# Altium schematic sheet Power_Stage.SchDoc
size A4; DocumentNumber: 3; SheetNumber: 3; SheetTotal: 3
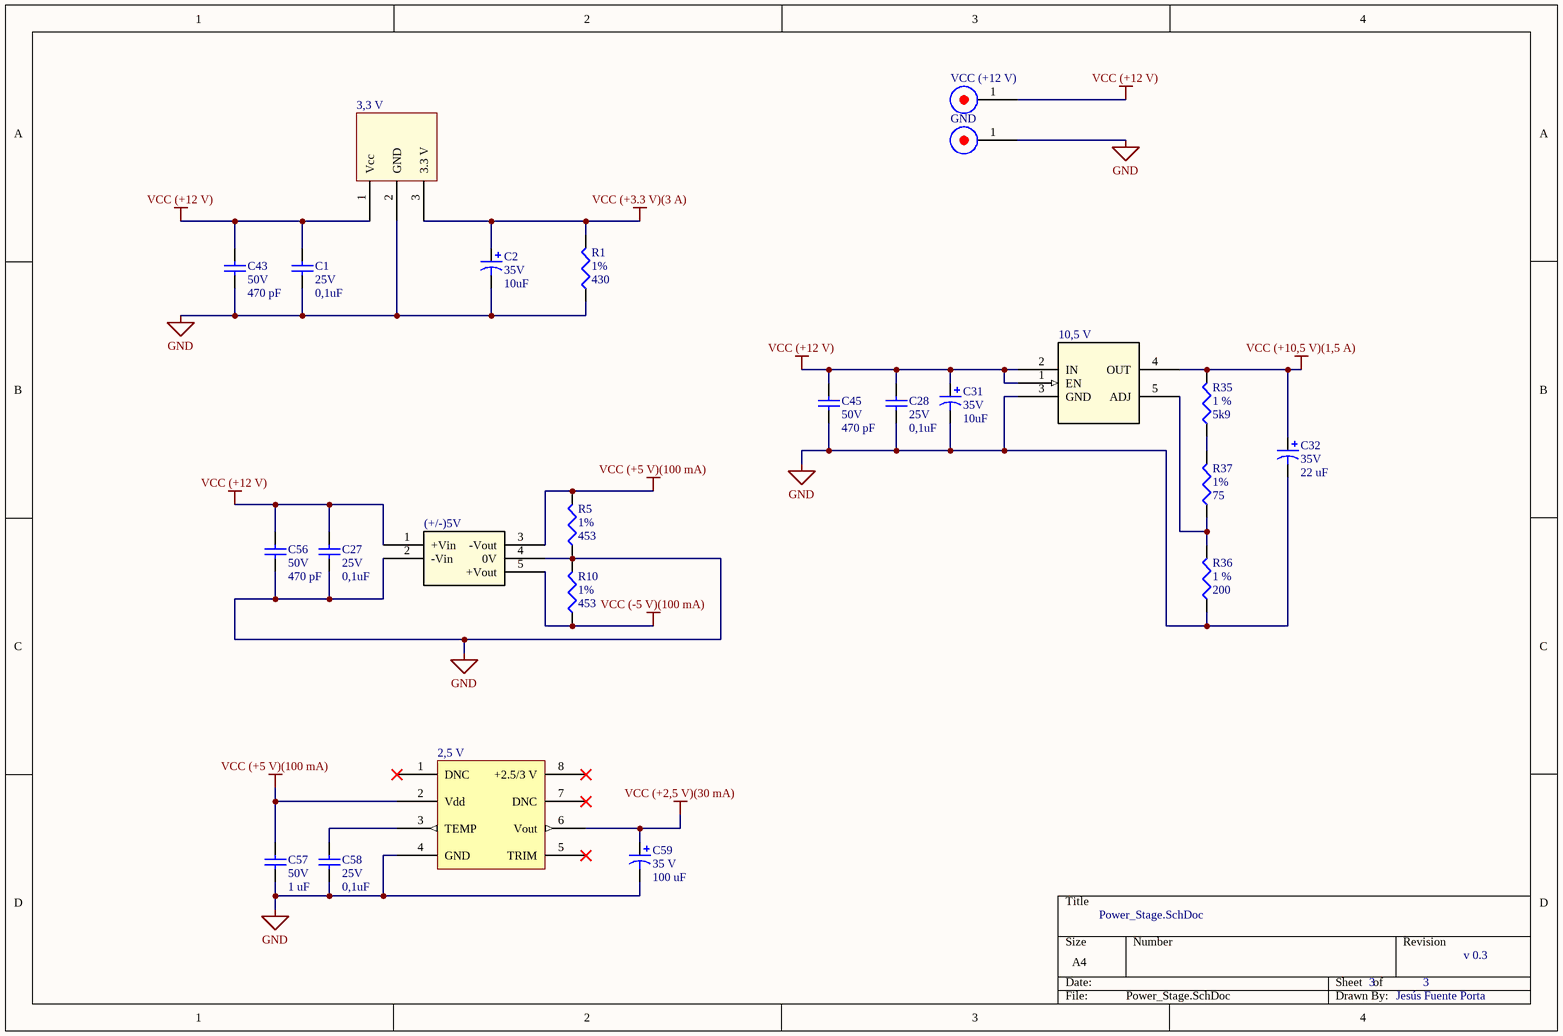
[diagram p0: Power_Stage.SchDoc]

## Parts
2,5_V  AD780CRZ  [AD780ARZ]  (value not drawn)
3,3_V  MIC29300-3.3WU  [MIC29300]  (value not drawn)
10,5_V  MIC29152WU  [MIC29152WU]  (value not drawn)
(+/-)5V  IA1205S  [IA0305S]  (value not drawn)
C1  25V  value 0,1uF  [1206 [Métrica 3216]]
C2  35V  value 10uF  [EEE1VA100WR]
C27  25V  value 0,1uF  [1206 [Métrica 3216]]
C28  25V  value 0,1uF  [1206 [Métrica 3216]]
C31  35V  value 10uF  [EEE1VA100WR]
C32  35V  value 22 uF  [EEE1VA220WR]
C43  50V  value 470 pF  [1206 [Métrica 3216]]
C45  50V  value 470 pF  [1206 [Métrica 3216]]
C56  50V  value 470 pF  [1206 [Métrica 3216]]
C57  50V  value 1 uF  [1206 [Métrica 3216]]
C58  25V  value 0,1uF  [1206 [Métrica 3216]]
C59  35 V  value 100 uF  [EEE-1VA101XP]
GND  Banana connector  [Banana Connector]  (value not drawn)
R1  1%  value 430  [1206 [Métrica 3216]]
R5  1%  value 453  [1206 [Métrica 3216]]
R10  1%  value 453  [1206 [Métrica 3216]]
R35  1 %  value 5k9  [1206 [Métrica 3216]]
R36  1 %  value 200  [1206 [Métrica 3216]]
R37  1%  value 75  [1206 [Métrica 3216]]
VCC_(+12_V)  Banana connector  [Banana Connector]  (value not drawn)

## Nets
GND: 2,5_V.4(GND) 3,3_V.2(GND) 10,5_V.3(GND) (+/-)5V.2(-Vin) (+/-)5V.4(0V) C1.1 C2.2 C27.1 C28.1 C31.2 C32.2 C43.1 C45.1 C56.1 C57.1 C58.1 C59.2 GND.1(IN) R1.1 R5.1 R10.2 R36.1
VCC (+2,5 V)(30 mA): 2,5_V.6(Vout) C59.1
VCC (+3.3 V)(3 A): 3,3_V.3(3.3_V) C2.1 R1.2
VCC (+5 V)(100 mA): 2,5_V.2(Vdd) (+/-)5V.3(-Vout) C57.2 R5.2
VCC (+10,5 V)(1,5 A): 10,5_V.4(OUT) C32.1 R35.2
VCC (+12 V): 3,3_V.1(Vcc) 10,5_V.1(EN) 10,5_V.2(IN) (+/-)5V.1(+Vin) C1.2 C27.2 C28.2 C31.1 C43.2 C45.2 C56.2 VCC_(+12_V).1(IN)
VCC (-5 V)(100 mA): (+/-)5V.5(+Vout) R10.1
Net2,5_V_3: 2,5_V.3(TEMP) C58.2
Net10,5_V_5: 10,5_V.5(ADJ) R36.2 R37.1
NetR35_1: R35.1 R37.2

Not connected (* = marked no-connect by the designer): 2,5_V 1(DNC)* 5(TRIM)* 7(DNC)* 8(+2.5/3_V)*

## Notes on the sheet
- (near C1) Choose a capacitor with good characteristics above 250 kHz.
- (near R1) Minimum 3,3 V Regulator Load to Enable Voltage Regulation. In case of < 7 mA current Load, the Voltage Regulators doesn't regulate the output.
- Choose a capacitor with good characteristics above 250 kHz.
- (near C32) Minimum 10,5 V Regulator Load to Enable Voltage Regulation. In case of < 5 mA current Load, the Voltage Regulators doesn't regulate the output.
  (R35+R37) = R36 * (Vout/1.240 - 1)
- (near (+/-)5V) Choose a capacitor with good characteristics above 250 kHz.
- (near (+/-)5V) Vin = 12 V +/- 10 %
  Vin = [10,8 V ; 13,2 V]
- Minimum 5 V Regulator Load to Enable Voltage Regulation. In case of < 20 mA current Load, the Voltage Regulators doesn't regulate the output.
- Line Regulation = 1.2%/1% ∆Vin
  Load Regulation = 10% (20-100% load change)
  Setpoint Accuracy = ±3%
  Maximum Capacitive Load = ±100 µF
  Switching Frequency = Variable, 80 KHz typical
  Efficiency = 75%
- High Precision 2,5 V reference.
- v 0.3
- Jesús Fuente Porta

## Library data of the parts
2,5_V = AD780ARZ: AD780CRZ -  Referencia de Tensión, Alta Precisión, Serie - Programable, Serie AD780, 2.5V, 3V, NSOIC-8; ComponentLink1Description: Farnell Webpage; ComponentLink1URL: https://es.farnell.com/analog-devices/ad780arz/ref-de-tensi-n-serie-2-5v-3v-nsoic/dp/2112642?scope=partnumberlookahead&ost=AD780ARZ&searchref=searchlookahead&exaMfpn=true&ddkey=https%3Aes-ES%2FElement14_Spain%2Fw%2Fsearch; ComponentLink2Description: Farnell Webpage (Compatible Chip); ComponentLink2URL: https://es.farnell.com/analog-devices/ad780crz/ref-de-tensi-n-serie-2-5v-3v-nsoic/dp/2461818?st=AD780
3,3_V = MIC29300-3.3WU: MIC29300-3.3WU -  Regulador de Tensión Fija LDO, 2.5 V a 26 V, Caída de 370 mV, 3.3 Vout, 3 Aout, TO-263-3; ComponentLink1Description: Farnell WebPage; ComponentLink1URL: https://es.farnell.com/microchip/mic29300-3-3wu/ic-reg-ldo-3a-3-3v/dp/2510017?st=MIC29300-3.3WU
10,5_V = MIC29152WU: MIC29152WU -  Regulador de Tensión LDO, Ajustable, Entrada 2V a 26V, Caída 350mV, Salida 1.27V-25V/1.5A, TO-263-5; Manufacturer_Part_Number: MIC29152BU; Vendor: Micrel; Built_By: EMA_UL_Team; Copyright: Copyright (C) 2018 Accelerated Designs. All rights reserved; RefDes: RefDes; Type: DEV; Value: Value; ComponentLink1Description: Farnell WebPage; ComponentLink1URL: https://es.farnell.com/microchip/mic29152wu/ic-v-reg-ldo-1-5a-adj-smd-29152/dp/2510008?scope=partnumberlookahead&ost=MIC29152WU&searchref=searchlookahead&exaMfpn=true&ddkey=https%3Aes-ES%2FElement14_Spain%2Fw%2Fsearch
(+/-)5V = IA1205S: IA1205S -  Convertidor DC/DC Aislado de Montaje en Placa, Orificio Pasante, 1W, 5V, 100mA, -5V, 100mA; Manufacturer_Part_Number: MIC29152BU; Vendor: Micrel; Built_By: EMA_UL_Team; Copyright: Copyright (C) 2018 Accelerated Designs. All rights reserved; RefDes: RefDes; Type: DEV; Value: Value; ComponentLink1Description: Farnell WebPage; ComponentLink1URL: https://es.farnell.com/xp-power/ia1205s/converter-dc-dc-1w-5v/dp/8727546
C1 C27 C28 C58 = Cap Semi: VJ1206Y104KXXCW1BC -  Condensador de Cerámica Multicapa, 0.1 µF, 25 V, 1206 [Métrica 3216], ± 10%, X7R, VJ Series; Published: 8-Jun-2000; LatestRevisionDate: 29-May-2009; LatestRevisionNote: IPC-7351 Footprint Added.; PackageReference: C1206; Publisher: Altium Limited; PackageDescription: Chip Capacitor; ComponentLink1Description: Farnell; ComponentLink1URL: https://es.farnell.com/vishay/vj1206y104kxxcw1bc/conden-0-1-f-25v-10-x7r-1206/dp/2896645
C2 C31 = Cap Pol3: EEE1VA100WR -  Condensador Electrolítico Aluminio SMD, Radial - SMD, 10 µF, 35 V, S Series, 1000 horas a 85°C; Published: 8-Jun-2000; LatestRevisionDate: 29-May-2009; LatestRevisionNote: IPC-7351 Footprint Added.; PackageReference: C0805; Publisher: Altium Limited; PackageDescription: Chip Capacitor; ComponentLink1Description: Farnell; ComponentLink1URL: https://es.farnell.com/panasonic/eee1va100wr/conden-10-f-35v-smd/dp/2808004?st=EEE1VA100WR
C32 = Cap Pol3: EEE1VA220WR -  Condensador Electrolítico Aluminio SMD, Radial - SMD, 22 µF, 35 V, Serie S, 1000 horas a 85°C; Published: 8-Jun-2000; LatestRevisionDate: 29-May-2009; LatestRevisionNote: IPC-7351 Footprint Added.; PackageReference: C0805; Publisher: Altium Limited; PackageDescription: Chip Capacitor; ComponentLink1Description: Farnell Webpage; ComponentLink1URL: https://es.farnell.com/panasonic/eee1va220wr/conden-22-f-35v-radial-smd/dp/2326173?st=EEE1VA220WR
C43 C45 C56 = Cap Semi: VJ1206A471JXACW1BC -  Condensador de Cerámica Multicapa, 470 pF, 50 V, 1206 [Métrica 3216], ± 5%, C0G / NP0, VJ Series; Published: 8-Jun-2000; LatestRevisionDate: 29-May-2009; LatestRevisionNote: IPC-7351 Footprint Added.; PackageReference: C1206; Publisher: Altium Limited; PackageDescription: Chip Capacitor; ComponentLink1Description: Farnell; ComponentLink1URL: https://es.farnell.com/vishay/vj1206a471jxacw1bc/conden-470pf-50v-5-c0g-np0-1206/dp/2896616
C57 = Cap Semi: MC1206B105K500CT -  Condensador de Cerámica Multicapa, 1 µF, 50 V, 1206 [Métrica 3216], ± 10%, X7R, Serie MC; Published: 8-Jun-2000; LatestRevisionDate: 29-May-2009; LatestRevisionNote: IPC-7351 Footprint Added.; PackageReference: C1206; Publisher: Altium Limited; PackageDescription: Chip Capacitor; ComponentLink1Description: Farnell Webpage; ComponentLink1URL: https://es.farnell.com/multicomp/mcsh31b105k500ct/conden-1-f-50v-10-x7r-1206/dp/1856643
C59 = Cap Pol3: EEE1VA101XP -  Condensador Electrolítico Aluminio SMD, Radial - SMD, 100 µF, 35 V, Serie S, 2000 horas a 85°C; Published: 8-Jun-2000; LatestRevisionDate: 29-May-2009; LatestRevisionNote: IPC-7351 Footprint Added.; PackageReference: C0805; Publisher: Altium Limited; PackageDescription: Chip Capacitor; ComponentLink1Description: Farnell Webpage; ComponentLink1URL: https://es.farnell.com/panasonic/eee1va101xp/conden-100-f-35v-radial-smd/dp/2326172?st=EEE1VA101XP
GND = Banana connector: FCR7350B -  Conector Banana de Prueba, 4mm, Hembra, Montaje en PCB, 24 A, 1 kV, Contactos Chapados en Oro; ComponentLink1Description: Farnell Webpage; ComponentLink1URL: https://es.farnell.com/cliff-electronic-components/fcr7350b/toma-pcb-4-mm-r-a-s16n-pc-negro/dp/1854507
R1 = Res3: MCWR12X4300FTL -  Resistencia SMD de Tipo Chip, Película Gruesa, 1206 [Métrica 3216], 430 ohm, Serie MCWR, 200 V; Published: 8-Jun-2000; LatestRevisionDate: 29-May-2009; LatestRevisionNote: IPC-7351 Footprint Added.; PackageReference: J1-0603; Publisher: Altium Limited; PackageDescription: Chip Resistor; ComponentLink1Description: Farnell Webpage; ComponentLink1URL: https://es.farnell.com/multicomp/mcwr12x4300ftl/res-430r-1-0-25w-1206-pel-c-gruesa/dp/2447518
R5 R10 = Res3: CRCW1206453RFKEA. -  Resistencia SMD de Tipo Chip, Película Gruesa, 1206 [Métrica 3216], 453 ohm, Serie CRCW, 200 V; Published: 8-Jun-2000; LatestRevisionDate: 29-May-2009; LatestRevisionNote: IPC-7351 Footprint Added.; PackageReference: J1-0603; Publisher: Altium Limited; PackageDescription: Chip Resistor; ComponentLink1Description: Farnell Webpage; ComponentLink1URL: https://es.farnell.com/vishay/crcw1206453rfkea/res-453r-1-0-25w-1206-pel-c-gruesa/dp/2139409
R35 = Res3: ERJ8ENF5901V -  Resistencia SMD de Tipo Chip, Película Gruesa, 1206 [Métrica 3216], 5.9 kohm, Serie ERJ8E, 200 V; Published: 8-Jun-2000; LatestRevisionDate: 29-May-2009; LatestRevisionNote: IPC-7351 Footprint Added.; PackageReference: J1-0603; Publisher: Altium Limited; PackageDescription: Chip Resistor; ComponentLink1Description: Farnell Webpage; ComponentLink1URL: https://es.farnell.com/panasonic/erj8enf5901v/res-5k9-1-0-25w-1206-pel-c-gruesa/dp/2307783
R36 = Res3: MCWR12X2000FTL -  Resistencia SMD de Tipo Chip, Película Gruesa, 1206 [Métrica 3216], 200 ohm, Serie MCWR, 200 V; Published: 8-Jun-2000; LatestRevisionDate: 29-May-2009; LatestRevisionNote: IPC-7351 Footprint Added.; PackageReference: J1-0603; Publisher: Altium Limited; PackageDescription: Chip Resistor; ComponentLink1Description: Farnell Webpage; ComponentLink1URL: https://es.farnell.com/multicomp/mcwr12x2000ftl/res-200r-1-0-25w-1206-pel-c-gruesa/dp/2447482
R37 = Res3: ERJ8ENF75R0V -  Resistencia SMD de Tipo Chip, Película Gruesa, 1206 [Métrica 3216], 75 ohm, Serie ERJ8E, 200 V; Published: 8-Jun-2000; LatestRevisionDate: 29-May-2009; LatestRevisionNote: IPC-7351 Footprint Added.; PackageReference: J1-0603; Publisher: Altium Limited; PackageDescription: Chip Resistor; ComponentLink1Description: Farnell Webpage; ComponentLink1URL: https://es.farnell.com/panasonic/erj8enf75r0v/res-75r-1-0-25w-1206-pel-c-gruesa/dp/2057747
VCC_(+12_V) = Banana connector: FCR7350R -  Conector Banana de Prueba, 4mm, Hembra, Montaje en PCB, 24 A, 1 kV, Contactos Chapados en Oro, Rojo; ComponentLink1Description: Farnell Webpage; ComponentLink1URL: https://es.farnell.com/cliff-electronic-components/fcr7350r/toma-pcb-4-mm-r-a-s16n-pc-rojo/dp/1854508